# EAGLE design MCP4725 (EAGLE 9.6.2)
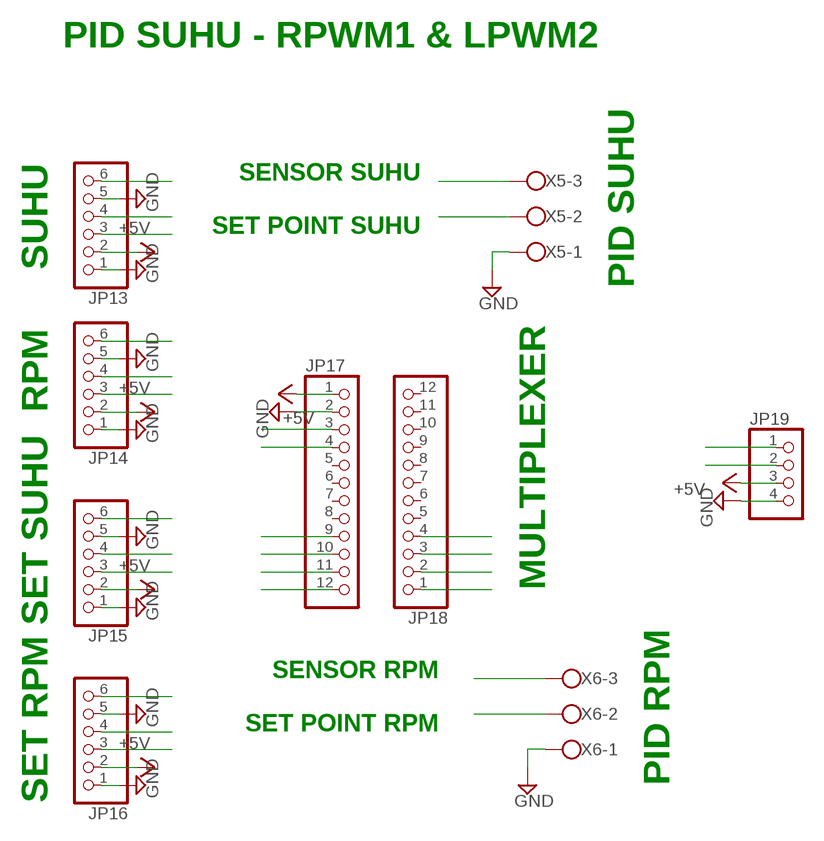
[diagram p0: schematic, sheet 1]

## Parts
JP13  PINHD-1X6  [1X06]
JP14  PINHD-1X6  [1X06]
JP15  PINHD-1X6  [1X06]
JP16  PINHD-1X6  [1X06]
JP17  PINHD-1X12  [1X12]
JP18  PINHD-1X12  [1X12]
JP19  PINHD-1X4  [1X04]
X5  W237-103  [W237-103]
X6  W237-103  [W237-103]

## Nets
+5V: JP13.2 JP14.2 JP15.2 JP16.2 JP17.1 JP19.3
GND: JP13.1 JP13.5 JP14.1 JP14.5 JP15.1 JP15.5 JP16.1 JP16.5 JP17.2 JP19.4 X5.1 X6.1
N$37: JP13.3 JP17.9
N$38: JP13.4 JP17.10
N$39: JP14.3 JP17.11
N$40: JP14.4 JP17.12
N$41: JP15.3 JP18.1
N$42: JP15.4 JP18.2
N$43: JP16.4 JP18.4
N$44: JP16.3 JP18.3
N$45: JP17.3 JP19.2
N$46: JP17.4 JP19.1
N$47: JP15.6 X5.2
N$48: JP13.6 X5.3
N$49: JP14.6 X6.3
N$50: JP16.6 X6.2
Unconnected: JP17.5 JP17.6 JP17.7 JP17.8 JP18.5 JP18.6 JP18.7 JP18.8 JP18.9 JP18.10 JP18.11 JP18.12

## Notes on the sheet
- PID SUHU - RPWM1 & LPWM2
- SENSOR SUHU
- SET POINT SUHU
- SUHU
- PID SUHU
- RPM
- MULTIPLEXER
- SET SUHU
- SENSOR RPM
- SET POINT RPM
- PID RPM
- SET RPM

## Library data of the parts
JP13-JP16 = pinhead:PINHD-1X6: PIN HEADER
JP17 JP18 = pinhead:PINHD-1X12: PIN HEADER
JP19 = pinhead:PINHD-1X4: PIN HEADER
X5 X6 = con-wago-500:W237-103: WAGO SCREW CLAMP; MPN: 237-103; OC_FARNELL: unknown; OC_NEWARK: 18M7116

## Board
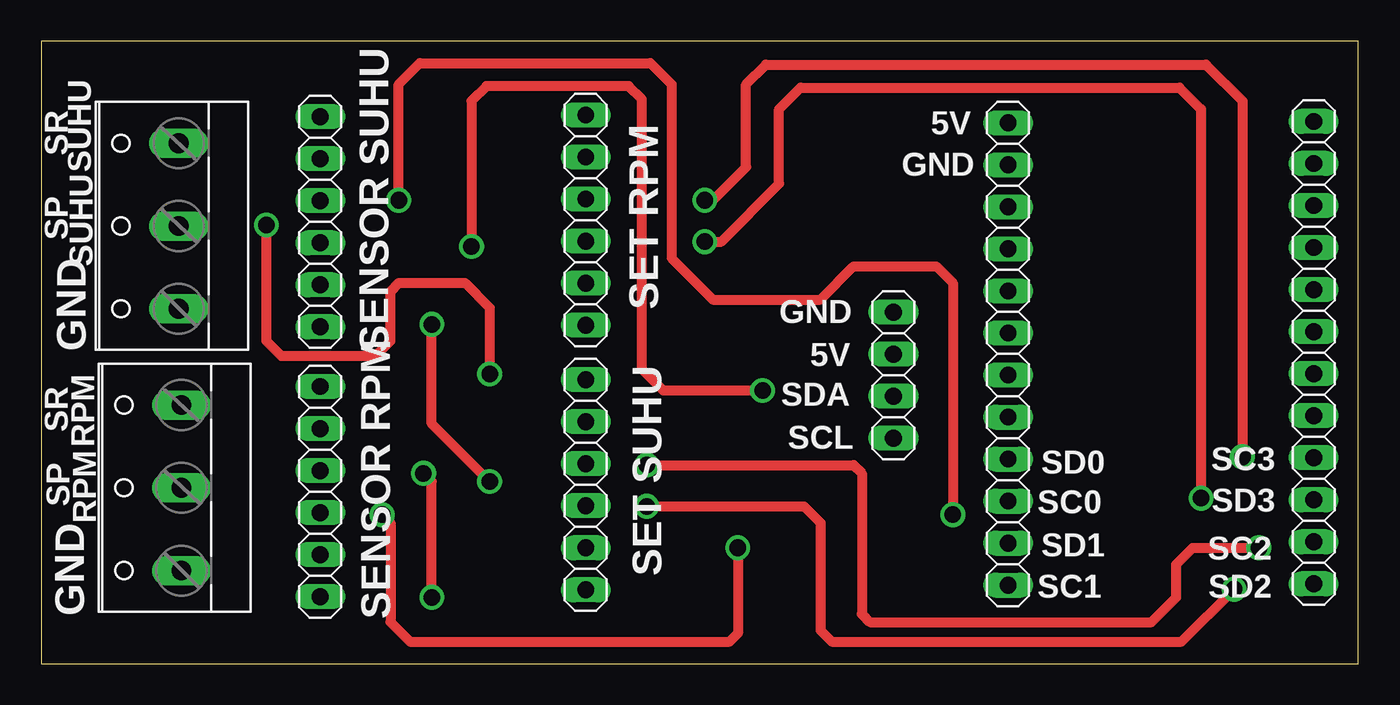
[diagram p1: board, top side]
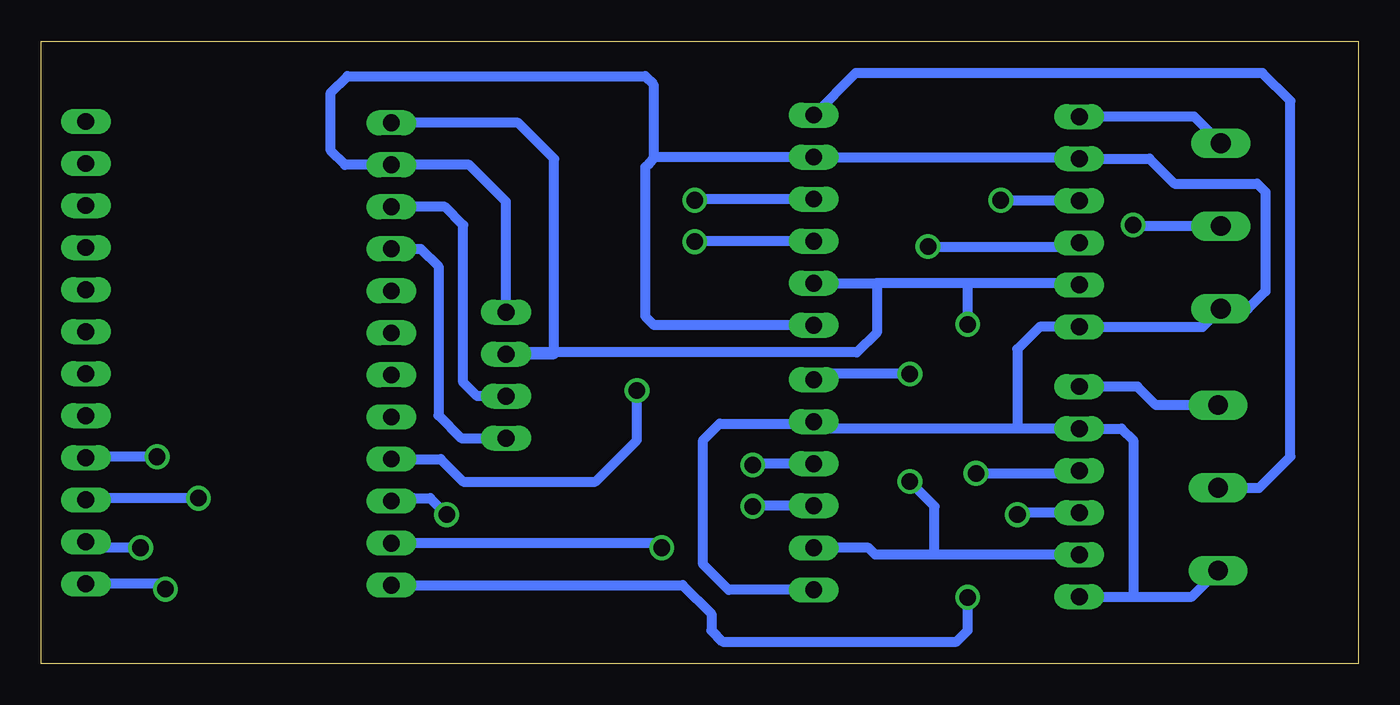
[diagram p2: board, bottom side, seen from below]

Size 79.6 x 37.6 mm. Coordinates in mm from the lower left corner, seen from the top.
Outline: 0,0 79.6,0 79.6,37.6 0,37.6 0,0
Copper layers (1*16): Top 0.035mm / dielectric 1.5mm / Bottom 0.035mm
Design rules "default": minimum track width 6mil, minimum drill 0.35mm, track to track 6mil, track to pad 6mil, pad to pad 6mil, via to via 6mil, smd to smd 6mil, copper to edge 40mil, drill to drill 6mil, minimum pad ring 10mil, minimum via ring 8mil, stop-mask expansion 4mil, vias tented up to drill 0mil, thermal gap 10mil

### Footprints (pad centres in the part's own frame; a part is rotated, then mirrored left to right if it is on the bottom)
1X06 = drill 1.016 long: 1 -6.35,0; 2 -3.81,0; 3 -1.27,0; 4 1.27,0; 5 3.81,0; 6 6.35,0
1X12 = drill 1.016 long: 1 -13.97,0; 2 -11.43,0; 3 -8.89,0; 4 -6.35,0; 5 -3.81,0; 6 -1.27,0; 7 1.27,0; 8 3.81,0; 9 6.35,0; 10 8.89,0; 11 11.43,0; 12 13.97,0
1X04 = drill 1.016 long: 1 -3.81,0; 2 -1.27,0; 3 1.27,0; 4 3.81,0
W237-103 = drill 1.194 long: 1 -5,-1.29; 2 0,-1.29; 3 5,-1.29

### Placement (x,y rotation side)
JP13  16.86,26.7 90 top
JP14  16.86,10.39 90 top
JP15  32.91,10.81 90 top
JP16  32.91,26.8 90 top
JP17  58.44,18.71 270 top
JP18  76.91,18.79 90 top
JP19  51.51,17.43 90 top
X5  7.01,26.44 90 top
X6  7.18,10.62 90 top

### Tracks (layer width: path | path; a pad name or v marks a point on that pad's centre or on a via)
+5V  (via drill 1 pad 1)
  Top 0.61: v27.1,11 23.6,14.5 v23.6,20.5
  Bottom 0.61: JP14.2 25.6,6.58 | 25.6,6.58 29.18,6.58 29.6,7 JP15.2 | JP13.2 16.96,22.99 23.6,22.99 | 23.6,22.99 29.1,22.99 | JP16.2 29.1,22.99 | JP19.3 50.6,18.7 | 50.6,18.7 48.6,18.7 48.6,30.5 50.78,32.68 JP17.1 | 25.6,6.58 25.6,9.5 v27.1,11 | v23.6,20.5 23.6,22.99 | 29.1,22.99 29.1,20 30.3,18.8 50.5,18.8 50.6,18.7
GND
  Bottom 0.61: 20.6,14.2 JP14.5 14.3,14.2 13.6,13.5 13.6,4.04 | 20.6,14.2 32.49,14.2 JP15.5 33.03,14.5 38.6,14.5 39.6,13.5 39.6,6 38.06,4.46 JP15.1 | JP14.1 13.6,4.04 | 13.6,4.04 10.05,4.04 X6.1 | JP16.1 42.55,20.45 43.1,21 43.1,30 42.85,30.25 42.6,30.5 | 42.6,30.5 42.49,30.61 JP16.5 16.96,30.61 JP13.5 12.61,30.51 11.1,29 6.1,29 5.6,28.5 5.6,22.5 6.66,21.44 X5.1 9.39,20.35 JP13.1 19.25,20.35 20.6,19 20.6,14.2 | JP19.4 51.51,27.91 53.74,30.14 JP17.2 61.24,30.14 62.1,31 62.1,34.5 61.1,35.5 43.1,35.5 42.6,35 42.6,30.5
N$37  (via drill 1 pad 1)
  Top 0.61: v43.6,16.5 37.6,16.5 36.3,17.8 36.3,34.1 35.5,34.9 26.9,34.9 26,34 v26,25.2
  Bottom 0.61: JP17.9 55.46,12.36 54.1,11 46.1,11 43.6,13.5 v43.6,16.5 | v26,25.2 17.09,25.2 JP13.3
N$38  (via drill 1 pad 1)
  Top 0.61: v21.6,28 21.6,35 22.88,36.28 36.82,36.28 38.1,35 38.1,24.5 40.6,22 47.1,22 49.1,24 54.1,24 55.1,23 v55.1,9
  Bottom 0.61: JP13.4 21.57,27.97 v21.6,28 | JP17.10 57.3,9.82 57.12,10 56.1,10 v55.1,9
N$39  (via drill 1 pad 1)
  Top 0.61: v20.6,9 21.1,8.5 21.1,2.5 22.28,1.32 41.6,1.32 42.1,1.82 v42.1,7
  Bottom 0.61: JP14.3 20.48,9.12 v20.6,9 | v42.1,7 42.38,7.28 JP17.11
N$40  (via drill 1 pad 1)
  Top 0.61: v23.6,4 23.6,11 v23.1,11.5
  Bottom 0.61: JP17.12 40.84,4.74 39.1,3 39.1,2 38.42,1.32 24.28,1.32 23.6,2 v23.6,4 | v23.1,11.5 17.02,11.5 JP14.4
N$41  (via drill 1 pad 1)
  Top 0.61: v36.6,9.5 46.1,9.5 47.1,8.5 47.1,2 47.78,1.32 68.92,1.32 v72.1,4.5
  Bottom 0.61: JP15.3 36.56,9.54 v36.6,9.5 | v72.1,4.5 72.42,4.82 JP18.1
N$42  (via drill 1 pad 1)
  Top 0.61: v36.6,12 49.1,12 49.6,11.5 49.6,3 50.1,2.5 67.1,2.5 68.6,4 68.6,6 69.6,7 v73.6,7
  Bottom 0.61: JP15.4 36.52,12.08 v36.6,12 | v73.6,7 76.55,7 JP18.2
N$43  (via drill 1 pad 1)
  Top 0.61: v40.1,28 40.6,28 42.6,30 42.6,35 43.8,36.2 70.4,36.2 72.6,34 v72.6,12.5
  Bottom 0.61: JP16.4 40.03,28.07 v40.1,28 | v72.6,12.5 76.85,12.5 JP18.4
N$44  (via drill 1 pad 1)
  Top 0.61: v40.1,25.5 41.1,25.5 44.6,29 44.6,33.5 45.9,34.8 68.8,34.8 70.1,33.5 v70.1,10
  Bottom 0.61: JP16.3 40.07,25.53 v40.1,25.5 | v70.1,10 76.81,10 JP18.3
N$45
  Bottom 0.61: JP19.2 53.26,16.16 54.1,17 54.1,26.5 55.2,27.6 JP17.3
N$46
  Bottom 0.61: JP17.4 56.66,25.06 55.6,24 55.6,15 54.22,13.62 JP19.1
N$47  (via drill 1 pad 1)
  Top 0.61: v13.6,26.5 13.6,19.5 14.5,18.6 20.2,18.6 21.1,19.5 21.1,22.5 21.6,23 25.6,23 27.1,21.5 v27.1,17.5
  Bottom 0.61: X5.2 13.54,26.44 v13.6,26.5 | v27.1,17.5 32.57,17.5 JP15.6
N$48
  Bottom 0.61: X5.3 9.91,33.05 JP13.6
N$49
  Bottom 0.61: X6.3 12.22,15.62 13.34,16.74 JP14.6
N$50
  Bottom 0.61: X6.2 5.98,10.62 4.1,12.5 4.1,34 5.78,35.68 30.38,35.68 JP16.6

### Text on the board
tNames: 5V | SR | GND | SUHU | SP | SUHU | GND | SET RPM | GND | SENSOR SUHU | 5V | SDA | SR | SCL | RPM | SD0 | SC3 | SC0 | SD3 | SP | RPM | SD1 | SC2 | SET SUHU | SC1 | SD2 | GND | SENSOR RPM